# EasyEDA schematic remote_glove_1.0_2021-01-08.json
TITLE: Sheet_1; REV: 1.0; Date: 2020-12-17; Sheet: 1/1; Drawn By: DaniRogachev; Company: Your Company
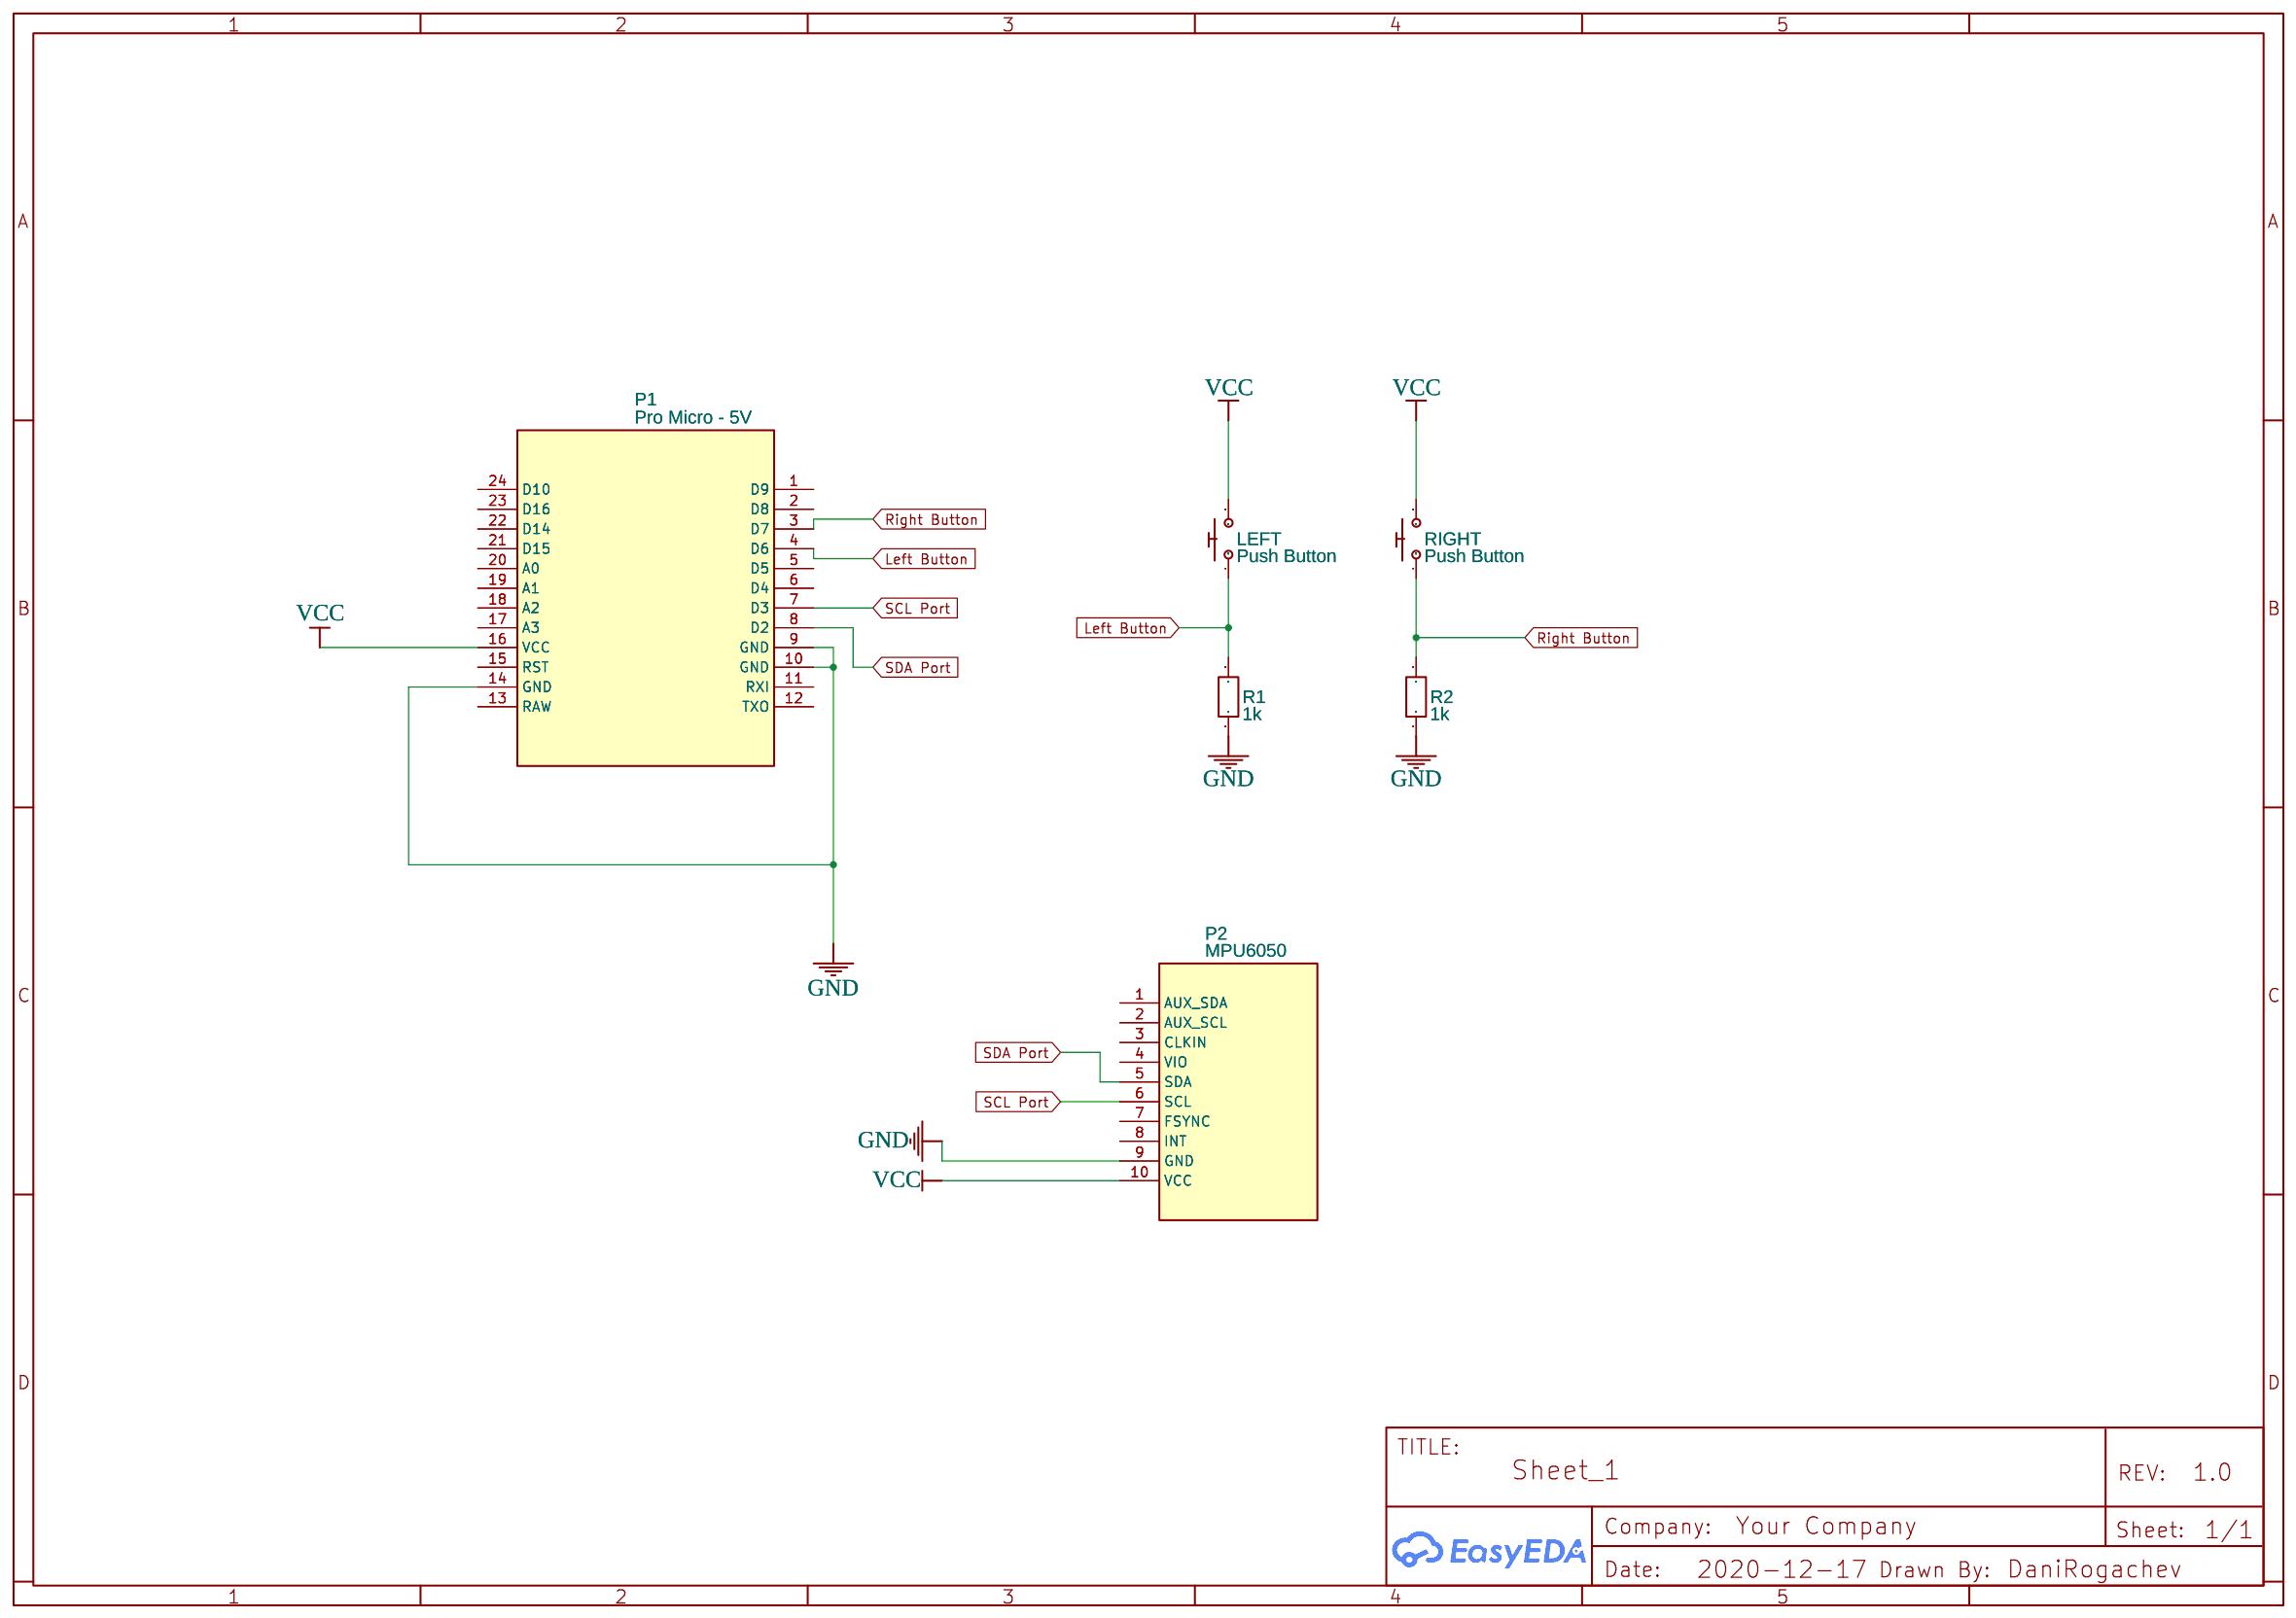
[diagram p0: schematic sheet]

## Parts
LEFT  Push Button  [SMD-BUTTON]
P1  Pro Micro - 5V  [PRO MICRO - 5V]
P2  MPU6050  [MPU6050]
R1  1k  [R0603]
R2  1k  [R0603]
RIGHT  Push Button  [SMD-BUTTON]

## Library data of the parts
LEFT RIGHT = Push Button: sourceId: M82WewO60; Supplier Part: COM-08720; Supplier: SparkFun
P1 = Pro Micro - 5V: sourceId: 1T5FDZYC8
P2 = MPU6050: sourceId: 1T5FDZYC8
R1 R2 = R_0603_EU: Contributor: LCEDA_Lib

## Nets
GND: P1.9(GND) P1.10(GND) P1.14(GND) P2.9(GND) R1.1 R2.1
VCC: LEFT.2(P$2) P1.16(VCC) P2.10(VCC) RIGHT.2(P$2)
Left Button: LEFT.1(P$1) P1.4(D6) R1.2
Right Button: P1.3(D7) R2.2 RIGHT.1(P$1)
SCL Port: P1.7(D3) P2.6(SCL)
SDA Port: P1.8(D2) P2.5(SDA)

Not connected (* = marked no-connect by the designer): P1 1(D9) 2(D8) 5(D5) 6(D4) 11(RXI) 12(TXO) 13(RAW) 15(RST) 17(A3) 18(A2) 19(A1) 20(A0) 21(D15) 22(D14) 23(D16) 24(D10); P2 1(AUX_SDA) 2(AUX_SCL) 3(CLKIN) 4(VIO) 7(FSYNC) 8(INT)
